# Altium schematic sheet board.SchDoc
size A
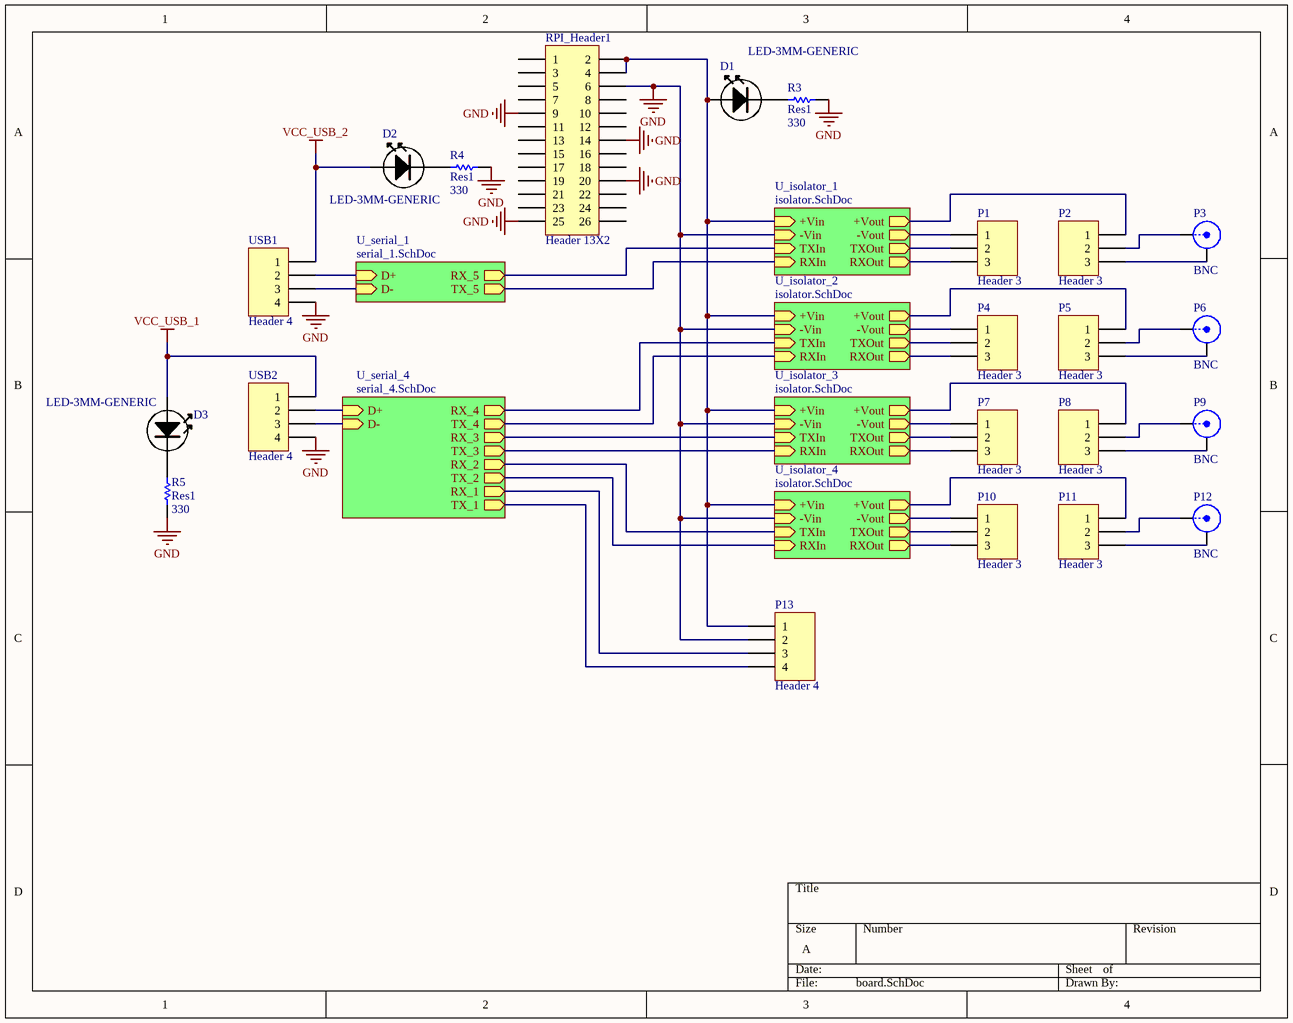
[diagram p0: board.SchDoc]

## Parts
D1  LED-3MM-GENERIC
D2  LED-3MM-GENERIC
D3  LED-3MM-GENERIC
P1  Header 3  [HDR1X3]
P2  Header 3  [HDR1X3]
P3  BNC  [BNC_RA CON]
P4  Header 3  [HDR1X3]
P5  Header 3  [HDR1X3]
P6  BNC  [BNC_RA CON]
P7  Header 3  [HDR1X3]
P8  Header 3  [HDR1X3]
P9  BNC  [BNC_RA CON]
P10  Header 3  [HDR1X3]
P11  Header 3  [HDR1X3]
P12  BNC  [BNC_RA CON]
P13  Header 4  [HDR1X4]
R3  Res1  value 330  [0805R-330]
R4  Res1  value 330  [0805R-330]
R5  Res1  value 330  [0805R-330]
RPI_Header1  Header 13X2  [HDR2X13]
USB1  Header 4  [HDR1X4]
USB2  Header 4  [HDR1X4]

## Sub-sheets
U_isolator_1 = isolator.SchDoc: +Vin (in), -Vin (in), +Vout (out), -Vout (out), TXIn (in), RXIn (in), TXOut (out), RXOut (out)
U_isolator_2 = isolator.SchDoc: +Vin (in), -Vin (in), +Vout (out), -Vout (out), TXIn (in), RXIn (in), TXOut (out), RXOut (out)
U_isolator_3 = isolator.SchDoc: +Vin (in), -Vin (in), +Vout (out), -Vout (out), TXIn (in), RXIn (in), TXOut (out), RXOut (out)
U_isolator_4 = isolator.SchDoc: +Vin (in), -Vin (in), +Vout (out), -Vout (out), TXIn (in), RXIn (in), TXOut (out), RXOut (out)
U_serial_1 = serial_1.SchDoc: RX_5 (out), TX_5 (out), D+ (in), D- (in)
U_serial_4 = serial_4.SchDoc: RX_4 (out), TX_4 (out), RX_3 (out), TX_3 (out), RX_2 (out), TX_2 (out), RX_1 (out), TX_1 (out), D+ (in), D- (in)

## Nets
GND: P13.2 R3.2 R4.2 R5.1 RPI_Header1.6 RPI_Header1.9 RPI_Header1.14 RPI_Header1.20 RPI_Header1.25 USB1.4 USB2.4 ; sheet U_isolator_1/-Vin, sheet U_isolator_2/-Vin, sheet U_isolator_3/-Vin, sheet U_isolator_4/-Vin
VCC_USB_1: D3.A USB2.1
VCC_USB_2: D2.A USB1.1
NetD1_A: D1.A P13.1 RPI_Header1.2 RPI_Header1.4 ; sheet U_isolator_1/+Vin, sheet U_isolator_2/+Vin, sheet U_isolator_3/+Vin, sheet U_isolator_4/+Vin
NetD1_K: D1.K R3.1
NetD2_K: D2.K R4.1
NetD3_K: D3.K R5.2
NetP1_1: P1.1 ; sheet U_isolator_1/-Vout
NetP1_2: P1.2 ; sheet U_isolator_1/TXOut
NetP1_3: P1.3 ; sheet U_isolator_1/RXOut
NetP2_1: P2.1 ; sheet U_isolator_1/+Vout
NetP2_2: P2.2 P3.1(X)
NetP2_3: P2.3 P3.2(Y)
NetP4_1: P4.1 ; sheet U_isolator_2/-Vout
NetP4_2: P4.2 ; sheet U_isolator_2/TXOut
NetP4_3: P4.3 ; sheet U_isolator_2/RXOut
NetP5_1: P5.1 ; sheet U_isolator_2/+Vout
NetP5_2: P5.2 P6.1(X)
NetP5_3: P5.3 P6.2(Y)
NetP7_1: P7.1 ; sheet U_isolator_3/-Vout
NetP7_2: P7.2 ; sheet U_isolator_3/TXOut
NetP7_3: P7.3 ; sheet U_isolator_3/RXOut
NetP8_1: P8.1 ; sheet U_isolator_3/+Vout
NetP8_2: P8.2 P9.1(X)
NetP8_3: P8.3 P9.2(Y)
NetP10_1: P10.1 ; sheet U_isolator_4/-Vout
NetP10_2: P10.2 ; sheet U_isolator_4/TXOut
NetP10_3: P10.3 ; sheet U_isolator_4/RXOut
NetP11_1: P11.1 ; sheet U_isolator_4/+Vout
NetP11_2: P11.2 P12.1(X)
NetP11_3: P11.3 P12.2(Y)
NetP13_3: P13.3 ; sheet U_serial_4/RX_1
NetP13_4: P13.4 ; sheet U_serial_4/TX_1
NetUSB1_2: USB1.2 ; sheet U_serial_1/D+
NetUSB1_3: USB1.3 ; sheet U_serial_1/D-
NetUSB2_2: USB2.2 ; sheet U_serial_4/D+
NetUSB2_3: USB2.3 ; sheet U_serial_4/D-
(unnamed): sheet U_isolator_1/TXIn, sheet U_serial_1/RX_5
(unnamed): sheet U_isolator_1/RXIn, sheet U_serial_1/TX_5
(unnamed): sheet U_isolator_2/TXIn, sheet U_serial_4/RX_4
(unnamed): sheet U_isolator_2/RXIn, sheet U_serial_4/TX_4
(unnamed): sheet U_isolator_3/TXIn, sheet U_serial_4/RX_3
(unnamed): sheet U_isolator_3/RXIn, sheet U_serial_4/TX_3
(unnamed): sheet U_isolator_4/TXIn, sheet U_serial_4/RX_2
(unnamed): sheet U_isolator_4/RXIn, sheet U_serial_4/TX_2

Not connected (* = marked no-connect by the designer): RPI_Header1 1 3 5 7 8 10 11 12 13 15 16 17 18 19 21 22 23 24 26

## Library data of the parts
D1-D3 = LED-3MM-GENERIC: GENERIC LED 3MM
P1 P2 P4 P5 P7 P8 P10 P11 = Header 3: Header, 3-Pin; LatestRevisionDate: 17-Jul-2002; LatestRevisionNote: Re-released for DXP Platform.; Publisher: Altium Limited
P3 P6 P9 P12 = BNC: BNC Elbow Connector; LatestRevisionDate: 17-Jul-2002; LatestRevisionNote: Re-released for DXP Platform.; Publisher: Altium Limited
P13 USB1 USB2 = Header 4: Header, 4-Pin; LatestRevisionDate: 17-Jul-2002; LatestRevisionNote: Re-released for DXP Platform.; Publisher: Altium Limited
R3-R5 = Res1: Resistor; Published: 8-Jun-2000; LatestRevisionDate: 17-Jul-2002; LatestRevisionNote: Re-released for DXP Platform.; PackageReference: AXIAL-0.3; Publisher: Altium Limited; PackageDescription: Axial Device, Thru-Hole; 2 Leads; 0.3 in Pin Spacing
RPI_Header1 = Header 13X2: Header, 13-Pin, Dual row; LatestRevisionDate: 17-Jul-2002; LatestRevisionNote: Re-released for DXP Platform.; Publisher: Altium Limited